# EAGLE design bt_bio (EAGLE 6.6.0)
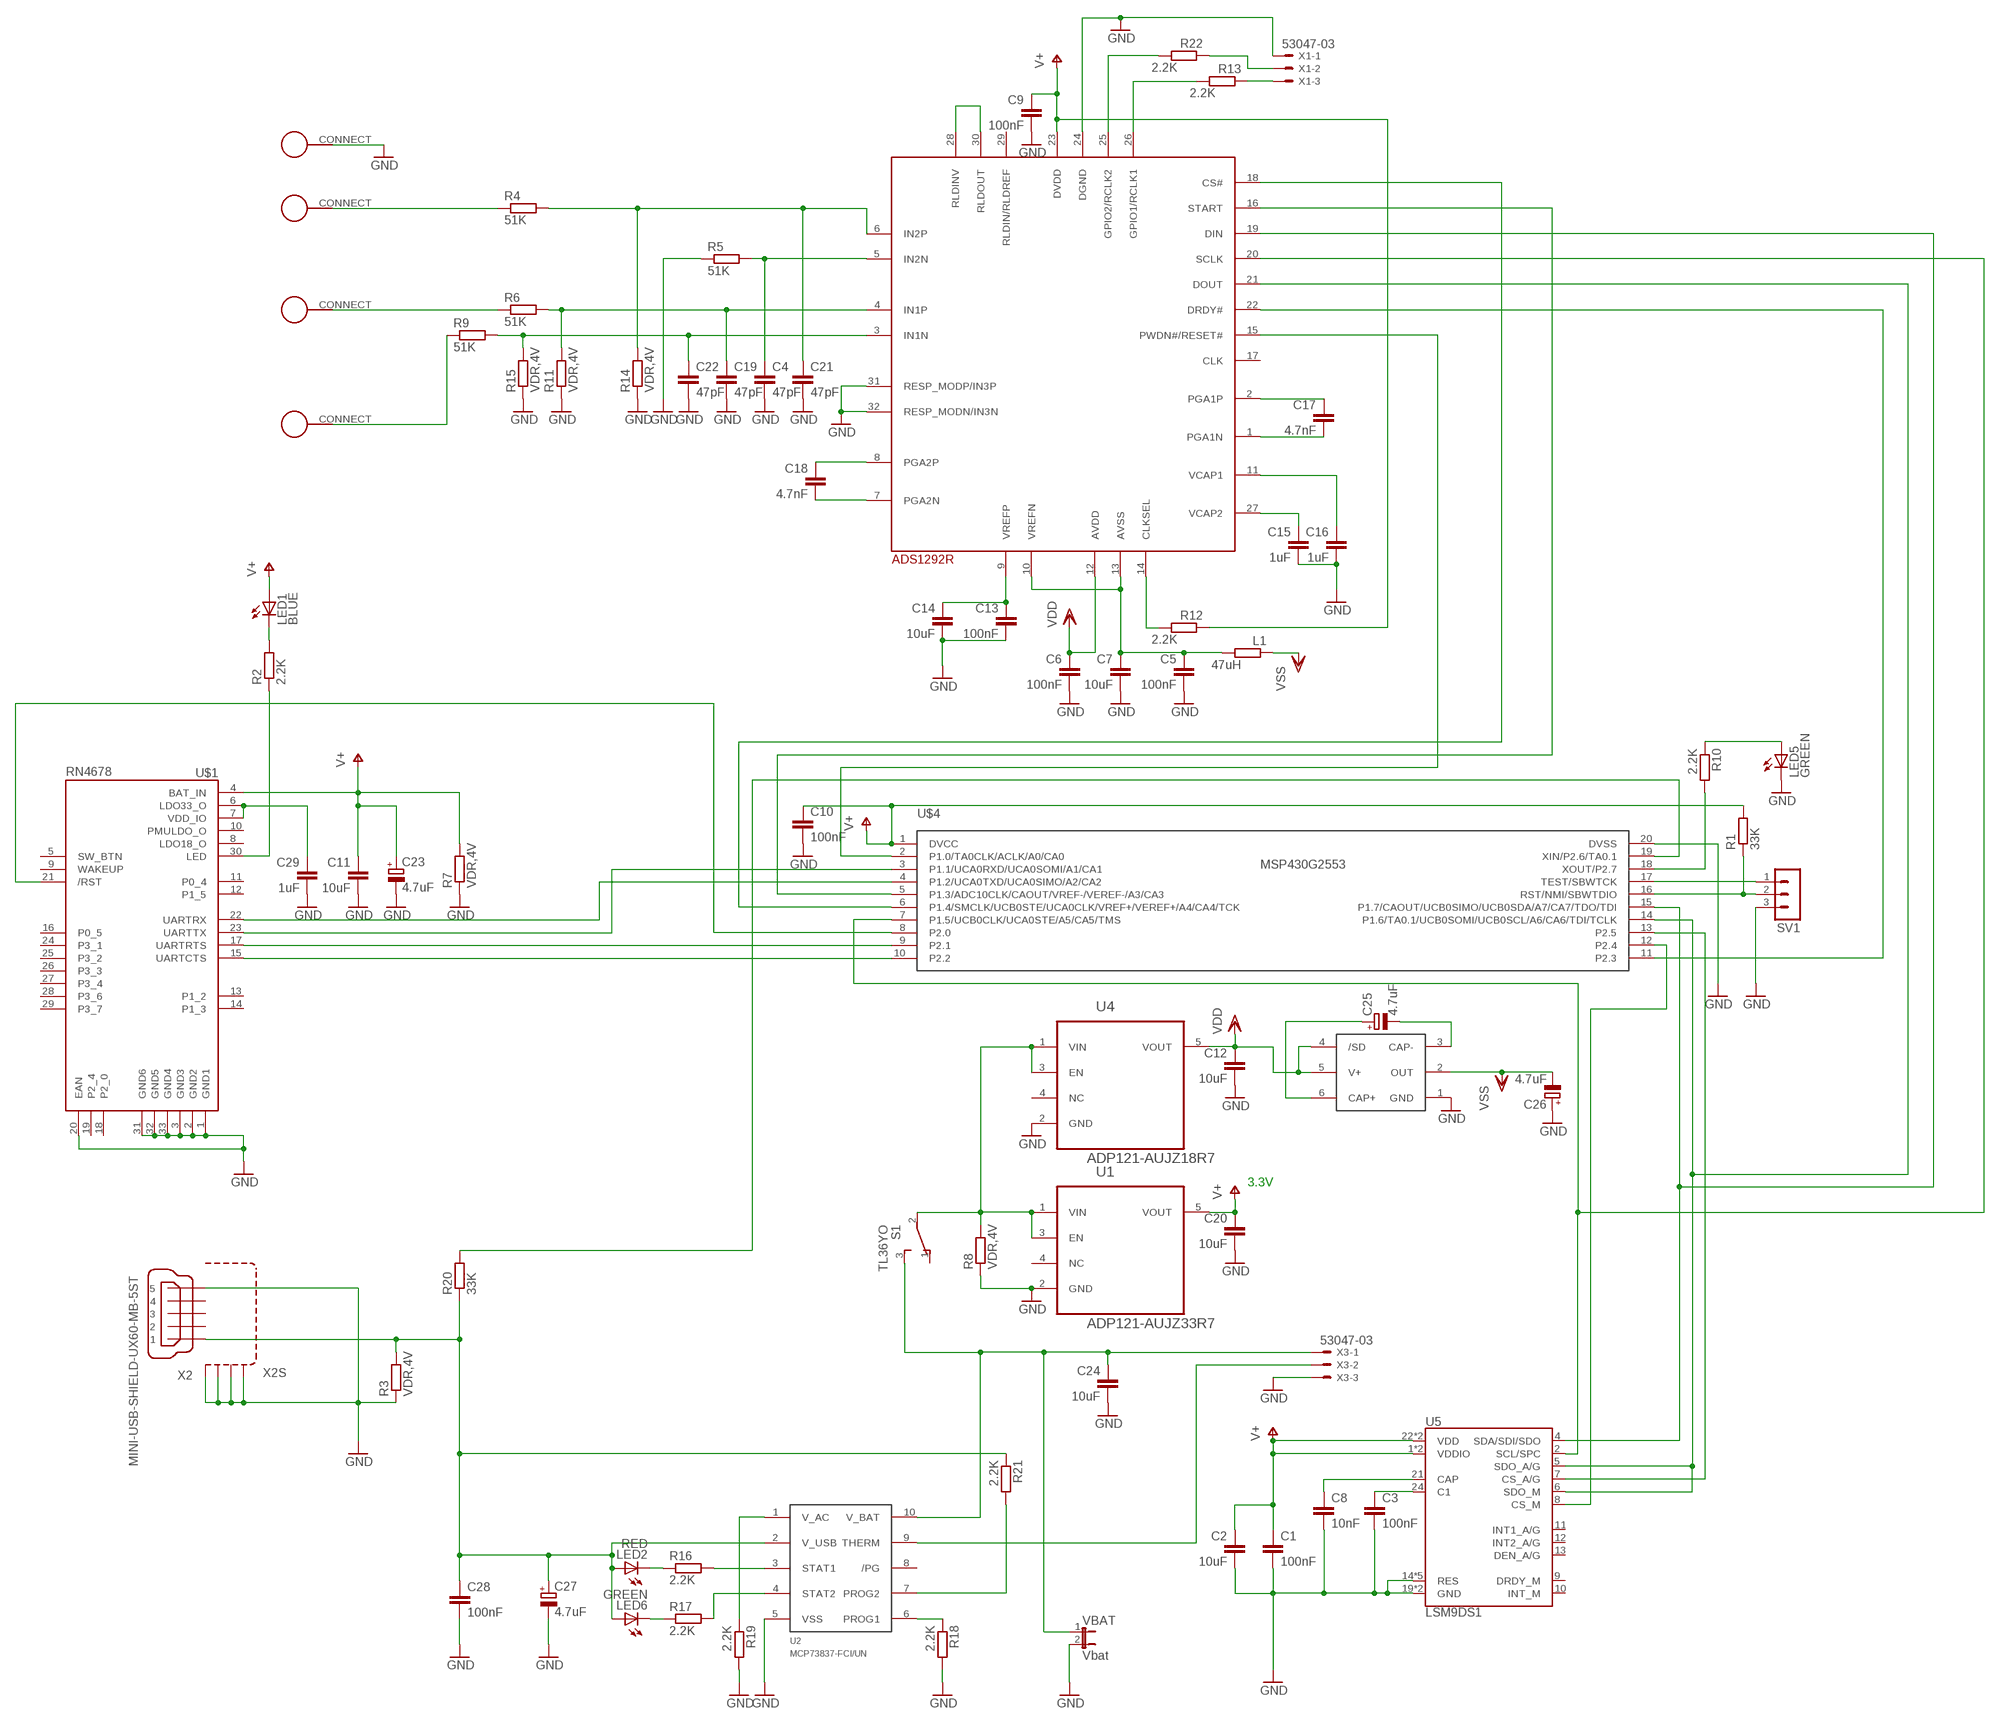
[diagram p0: schematic, sheet 1]

## Parts
ADS1292R  ADS1292R  [TQFP-32]
C1  100nF  C-EUC0603  [C0603]
C2  10uF  C-EUC1206  [C1206]
C3  100nF  C-EUC0603  [C0603]
C4  47pF  C-EUC0603  [C0603]
C5  100nF  C-EUC0603  [C0603]
C6  100nF  C-EUC0603  [C0603]
C7  10uF  C-EUC1206  [C1206]
C8  10nF  C-EUC0603  [C0603]
C9  100nF  C-EUC0603  [C0603]
C10  100nF  C-EUC0603  [C0603]
C11  10uF  C-EUC1206  [C1206]
C12  10uF  C-EUC1206  [C1206]
C13  100nF  C-EUC0603  [C0603]
C14  10uF  C-EUC1206  [C1206]
C15  1uF  C-EUC0603  [C0603]
C16  1uF  C-EUC0603  [C0603]
C17  4.7nF  C-EUC0603  [C0603]
C18  4.7nF  C-EUC0603  [C0603]
C19  47pF  C-EUC0603  [C0603]
C20  10uF  C-EUC1206  [C1206]
C21  47pF  C-EUC0603  [C0603]
C22  47pF  C-EUC0603  [C0603]
C23  4.7uF  CPOL-EUSMCC  [SMC_C]
C24  10uF  C-EUC1206  [C1206]
C25  4.7uF  CPOL-EUSMCC  [SMC_C]
C26  4.7uF  CPOL-EUSMCC  [SMC_C]
C27  4.7uF  CPOL-EUSMCC  [SMC_C]
C28  100nF  C-EUC0603  [C0603]
C29  1uF  C-EUC0603  [C0603]
L1  47uH  R-EU_R0805  [R0805]
LED1  BLUE  LEDCHIPLED_0805  [CHIPLED_0805]
LED2  RED  LEDCHIPLED_0805  [CHIPLED_0805]
LED5  GREEN  LEDCHIPLED_0805  [CHIPLED_0805]
LED6  GREEN  LEDCHIPLED_0805  [CHIPLED_0805]
R1  33K  R-EU_R0603  [R0603]
R2  2.2K  R-EU_R0603  [R0603]
R3  VDR,4V  R-EU_R0805  [R0805]
R4  51K  R-EU_R0603  [R0603]
R5  51K  R-EU_R0603  [R0603]
R6  51K  R-EU_R0603  [R0603]
R7  VDR,4V  R-EU_R0805  [R0805]
R8  VDR,4V  R-EU_R0805  [R0805]
R9  51K  R-EU_R0603  [R0603]
R10  2.2K  R-EU_R0603  [R0603]
R11  VDR,4V  R-EU_R0805  [R0805]
R12  2.2K  R-EU_R0603  [R0603]
R13  2.2K  R-EU_R0603  [R0603]
R14  VDR,4V  R-EU_R0805  [R0805]
R15  VDR,4V  R-EU_R0805  [R0805]
R16  2.2K  R-EU_R0603  [R0603]
R17  2.2K  R-EU_R0603  [R0603]
R18  2.2K  R-EU_R0603  [R0603]
R19  2.2K  R-EU_R0603  [R0603]
R20  33K  R-EU_R0603  [R0603]
R21  2.2K  R-EU_R0603  [R0603]
R22  2.2K  R-EU_R0603  [R0603]
S1  TL36YO  [TL3XYO]
SV1  MA03-1  [MA03-1]
U1  ADP121-AUJZ33R7  [SOT95P280X100-5N]
U2  MCP73837-FCI/UN  MCP73837  [MSOP10]
U4  ADP121-AUJZ18R7  ADP121-AUJZ33R7  [SOT95P280X100-5N]
U5  LSM9DS1  [LGA24-8X4]
U$1  RN4678  [RN4678]
U$4  MSP430G2553  [TSSOP20]
U$5  4MMCONNECT  [4MMCONNECT]
U$7  4MMCONNECT  [4MMCONNECT]
U$9  4MMCONNECT  [4MMCONNECT]
U$10  4MMCONNECT  [4MMCONNECT]
U$12  LM2664  [SOT-23-5]
VBAT  Vbat  JP1E  [JP1]
X1  53047-03  [53047-03]
X2  MINI-USB-SHIELD-UX60-MB-5ST  [UX60-MB-5ST]
X3  53047-03  [53047-03]

## Nets
+5V: C27.+ C28.1 LED2.A LED6.A R3.2 R20.1 R21.1 U2.2(V_USB) X2.1
CS/: U5.8(CS_M) U$4.12(P2.4)
CTS: U$1.15(UARTCTS) U$4.10(P2.2)
ECG_/CS: ADS1292R.18(CS#) U$4.6(P1.4/SMCLK/UCB0STE/UCA0CLK/VREF+/VEREF+/A4/CA4/TCK)
ECG_/DRDY: ADS1292R.22(DRDY#) U$4.11(P2.3)
ECG_START: ADS1292R.16(START) U$4.5(P1.3/ADC10CLK/CAOUT/VREF-/VEREF-/A3/CA3)
GND: ADS1292R.24(DGND) ADS1292R.31(RESP_MODP/IN3P) ADS1292R.32(RESP_MODN/IN3N) C1.2 C2.2 C3.2 C4.2 C5.2 C6.2 C7.2 C8.2 C9.2 C10.2 C11.2 C12.2 C13.2 C14.2 C15.2 C16.2 C19.2 C20.2 C21.2 C22.2 C23.- C24.2 C26.+ C27.- C28.2 C29.2 LED5.C R3.1 R5.1 R7.1 R8.1 R11.1 R14.1 R15.1 R18.2 R19.2 SV1.3 U1.2(GND) U2.5(VSS) U4.2(GND) U5.14(RES) U5.15(RES) U5.16(RES) U5.17(RES) U5.18(RES) U5.19(GND) U5.20(GND) U$1.1(GND1) U$1.2(GND2) U$1.3(GND3) U$1.20(EAN) U$1.31(GND6) U$1.32(GND5) U$1.33(GND4) U$4.20(DVSS) U$5.CONNECT U$12.1(GND) VBAT.2 X1.1 X2.5 X2.M1(S1) X2.M2(S2) X2.M3(S3) X2.M4(S4) X3.3
N$1: R1.1 SV1.2 U$4.16(RST/NMI/SBWTDIO)
N$2: C29.1 U$1.6(LDO33_O) U$1.7(VDD_IO)
N$3: ADS1292R.28(RLDINV) ADS1292R.30(RLDOUT)
N$4: ADS1292R.5(IN2N) C4.1 R5.2
N$5: SV1.1 U$4.17(TEST/SBWTCK)
N$6: R2.1 U$1.30(LED)
N$11: R8.2 S1.2(P) U1.1(VIN) U1.3(EN) U4.1(VIN) U4.3(EN)
N$12: ADS1292R.10(VREFN) ADS1292R.13(AVSS) C5.1 C7.1 L1.2
N$15: R10.2 U$4.18(XOUT/P2.7)
N$16: LED5.A R10.1
N$17: LED1.C R2.2
N$18: ADS1292R.25(GPIO2/RCLK2) R22.2
N$19: ADS1292R.9(VREFP) C13.1 C14.1
N$20: ADS1292R.27(VCAP2) C15.1
N$21: ADS1292R.26(GPIO1/RCLK1) R13.2
N$22: ADS1292R.11(VCAP1) C16.1
N$23: R20.2 U$4.19(XIN/P2.6/TA0.1)
N$24: ADS1292R.15(PWDN#/RESET#) U$4.2(P1.0/TA0CLK/ACLK/A0/CA0)
N$25: U5.7(CS_A/G) U$4.13(P2.5)
N$26: C3.1 U5.24(C1)
N$27: C8.1 U5.21(CAP)
N$28: R13.1 X1.3
N$30: R22.1 X1.2
N$31: C24.1 S1.3(S) U2.10(V_BAT) VBAT.1 X3.1
N$32: ADS1292R.2(PGA1P) C17.1
N$33: ADS1292R.1(PGA1N) C17.2
N$34: ADS1292R.8(PGA2P) C18.1
N$35: ADS1292R.7(PGA2N) C18.2
N$36: ADS1292R.14(CLKSEL) R12.2
N$37: ADS1292R.6(IN2P) C21.1 R4.2 R14.2
N$39: ADS1292R.3(IN1N) C22.1 R9.2 R15.2
N$40: ADS1292R.4(IN1P) C19.1 R6.2 R11.2
N$41: R4.1 U$7.CONNECT
N$42: R9.1 U$10.CONNECT
N$43: R6.1 U$9.CONNECT
N$47: C25.+ U$12.6(CAP+)
N$48: C25.- U$12.3(CAP-)
N$49: R16.2 U2.3(STAT1)
N$50: LED6.C R17.1
N$51: R17.2 U2.4(STAT2)
N$52: LED2.C R16.1
N$53: R18.1 U2.6(PROG1)
N$54: U2.9(THERM) X3.2
N$55: R19.1 U2.1(V_AC)
N$57: R21.2 U2.7(PROG2)
RESET: U$1.21(/RST) U$4.8(P2.0)
RTS: U$1.17(UARTRTS) U$4.9(P2.1)
RX: U$1.22(UARTRX) U$4.4(P1.2/UCA0TXD/UCA0SIMO/A2/CA2)
SPI_CLK: ADS1292R.20(SCLK) U5.2(SCL/SPC) U$4.7(P1.5/UCB0CLK/UCA0STE/A5/CA5/TMS)
SPI_MISO: ADS1292R.21(DOUT) U5.5(SDO_A/G) U5.6(SDO_M) U$4.14(P1.6/TA0.1/UCB0SOMI/UCB0SCL/A6/CA6/TDI/TCLK)
SPI_MOSI: ADS1292R.19(DIN) U5.4(SDA/SDI/SDO) U$4.15(P1.7/CAOUT/UCB0SIMO/UCB0SDA/A7/CA7/TDO/TDI)
TX: U$1.23(UARTTX) U$4.3(P1.1/UCA0RXD/UCA0SOMI/A1/CA1)
V+: ADS1292R.23(DVDD) C1.1 C2.1 C9.1 C10.1 C11.1 C20.1 C23.+ LED1.A R1.2 R7.2 R12.1 U1.5(VOUT) U5.1(VDDIO) U5.3(VDDIO) U5.22(VDD) U5.23(VDD) U$1.4(BAT_IN) U$4.1(DVCC)
VDD: ADS1292R.12(AVDD) C6.1 C12.1 U4.5(VOUT) U$12.4(/SD) U$12.5(V+)
VSS: C26.- L1.1 U$12.2(OUT)
Unconnected: ADS1292R.17(CLK) ADS1292R.29(RLDIN/RLDREF) S1.1(O) U1.4(NC) U2.8(/PG) U4.4(NC) U5.9(DRDY_M) U5.10(INT_M) U5.11(INT1_A/G) U5.12(INT2_A/G) U5.13(DEN_A/G) U$1.5(SW_BTN) U$1.8(LDO18_O) U$1.9(WAKEUP) U$1.10(PMULDO_O) U$1.11(P0_4) U$1.12(P1_5) U$1.13(P1_2) U$1.14(P1_3) U$1.16(P0_5) U$1.18(P2_0) U$1.19(P2_4) U$1.24(P3_1) U$1.25(P3_2) U$1.26(P3_3) U$1.27(P3_4) U$1.28(P3_6) U$1.29(P3_7) X2.2 X2.3 X2.4

## Notes on the sheet
- 3.3V

## Library data of the parts
ADS1292R = ewhbp:ADS1292R
C1-C22 C24 C28 C29 = rcl:C-EU: CAPACITOR, European symbol
C23 C25-C27 = rcl:CPOL-EU: POLARIZED CAPACITOR, European symbol
L1 R2-R19 R21 R22 = rcl:R-EU_: RESISTOR, European symbol
LED1 LED2 LED5 LED6 = led:LED: LED OSRAM: - CHIPLED LG R971, LG N971, LY N971, LG Q971, LY Q971, LO R971, LY R971 LH N974, LH R974 LS Q976, LO Q976, LY Q976 LO Q996 - Hyper CHIPLED LW Q18S LB Q993, LB Q99A, LB R99A - SideLED LS A670, LO A670, LY A670, LG A670, LP A670 LB A673, LV A673, LT A673, LW A673 LH A674 LY A675 LS A676, LA A676, LO A676, LY A676, LW A676 LS A679, LY A679, LG A679 - Hyper Micro SIDELED® LS Y876, LA Y876, LO Y876, LY Y876 LT Y87S - SmartLED LW L88C, LW L88S LB L89C, LB L89S, LG L890 LS L89K, LO L89K, LY L89K LS L896, LA L896, LO L896, LY L896 - TOPLED LS T670, LO T670, LY T670, LG T670, LP T670 LSG T670, LSP T670, LSY T670, LOP T670, LYG T670 LG T671, LOG T671, LSG T671 LB T673, LV T673, LT T673, LW T673 LH T674 LS T676, LA T676, LO T676, LY T676, LB T676, LH T676, LSB T676, LW T676 LB T67C, LV T67C, LT T67C, LS T67K, LO T67K, LY T67K, LW E67C LS E67B, LA E67B, LO E67B, LY E67B, LB E67C, LV E67C, LT E67C LW T67C LS T679, LY T679, LG T679 LS T770, LO T770, LY T770, LG T770, LP T770 LB T773, LV T773, LT T773, LW T773 LH T774 LS E675, LA E675, LY E675, LS T675 LS T776, LA T776, LO T776, LY T776, LB T776 LHGB T686 LT T68C, LB T68C - Hyper Mini TOPLED® LB M676 - Mini TOPLED Santana® LG M470 LS M47K, LO M47K, LY M47K Source: http://www.osram.convergy.de - LUMILED® LXK2-PW12-R00, LXK2-PW12-S00, LXK2-PW14-U00, LXK2-PW14-V00 LXK2-PM12-R00, LXK2-PM12-S00, LXK2-PM14-U00 LXK2-PE12-Q00, LXK2-PE12-R00, LXK2-PE12-S00, LXK2-PE14-T00, LXK2-PE14-U00 LXK2-PB12-K00, LXK2-PB12-L00, LXK2-PB12-M00, LXK2-PB14-N00, LXK2-PB14-P00, LXK2-PB14-Q00 LXK2-PR12-L00, LXK2-PR12-M00, LXK2-PR14-Q00, LXK2-PR14-R00 LXK2-PD12-Q00, LXK2-PD12-R00, LXK2-PD12-S00 LXK2-PH12-R00, LXK2-PH12-S00 LXK2-PL12-P00, LXK2-PL12-Q00, LXK2-PL12-R00 Source: www.luxeon.com
R1 R20 = resistor:R-EU_: RESISTOR, European symbol
S1 = switch:TL36YO: TINY SWITCH ON - ON Source: http://www2.produktinfo.conrad.com/datenblaetter/700000-724999/705152-da-01-de-Subminiaturschalter_TL_36YO.pdf
SV1 = con-lstb:MA03-1: PIN HEADER; OC_FARNELL: unknown; OC_NEWARK: unknown
U1 U4 = adp121:ADP121-AUJZ33R7: 150 mA, Low Quiescent Current, CMOS Linear Regulator; MPN: ADP121-AUJZ33R7; OC_FARNELL: 2074869; OC_NEWARK: 10R7024; PACKAGE: TSOT-5; SUPPLIER: Analog Devices
U2 = charger:MCP73837
U5 = LSM9DS1:LSM9DS1: LSM9DS1 3D accelerometer, gyroscope & magnetometer The LSM9DS1 is a system-in-package featuring a 3D digital linear acceleration sensor, a 3D digital angular rate sensor, and a 3D digital magnetic sensor. The LSM9DS1 has a linear acceleration full scale of ±2g/±4g/±8/±16 g, a magnetic field full scale of ±4/±8/±12/±16 gauss and an angular rate of ±245/±500/±2000 dps. The LSM9DS1 includes an I2 C serial bus interface supporting standard and fast mode (100 kHz and 400 kHz) and an SPI serial standard interface. Magnetic, accelerometer and gyroscope sensing can be enabled or set in power-down mode separately for smart power management. The LSM9DS1 is available in a plastic land grid array package (LGA) and it is guaranteed to operate over an extended temperature range from -40 °C to +85 °C.; PROD_ID: IC-12536
U$1 = rn4678:RN4678
U$4 = msp430g2553:MSP430G2553
U$5 U$7 U$9 U$10 = project1:4MMCONNECT
U$12 = charge_pump:LM2664
VBAT = jumper:JP1E: JUMPER
X1 X3 = con-molex:53?-03: CONNECTOR wire to board 1.25 mm (.049 inch) pitch header; MPN: 530470310; OC_FARNELL: 9732853; OC_NEWARK: 14R5412
X2 = con-hirose:MINI-USB-SHIELD-: MINI USB Connector Source: http://www.hirose.co.jp/cataloge_hp/e24000019.pdf; OC_FARNELL: unknown; OC_NEWARK: unknown

## Board
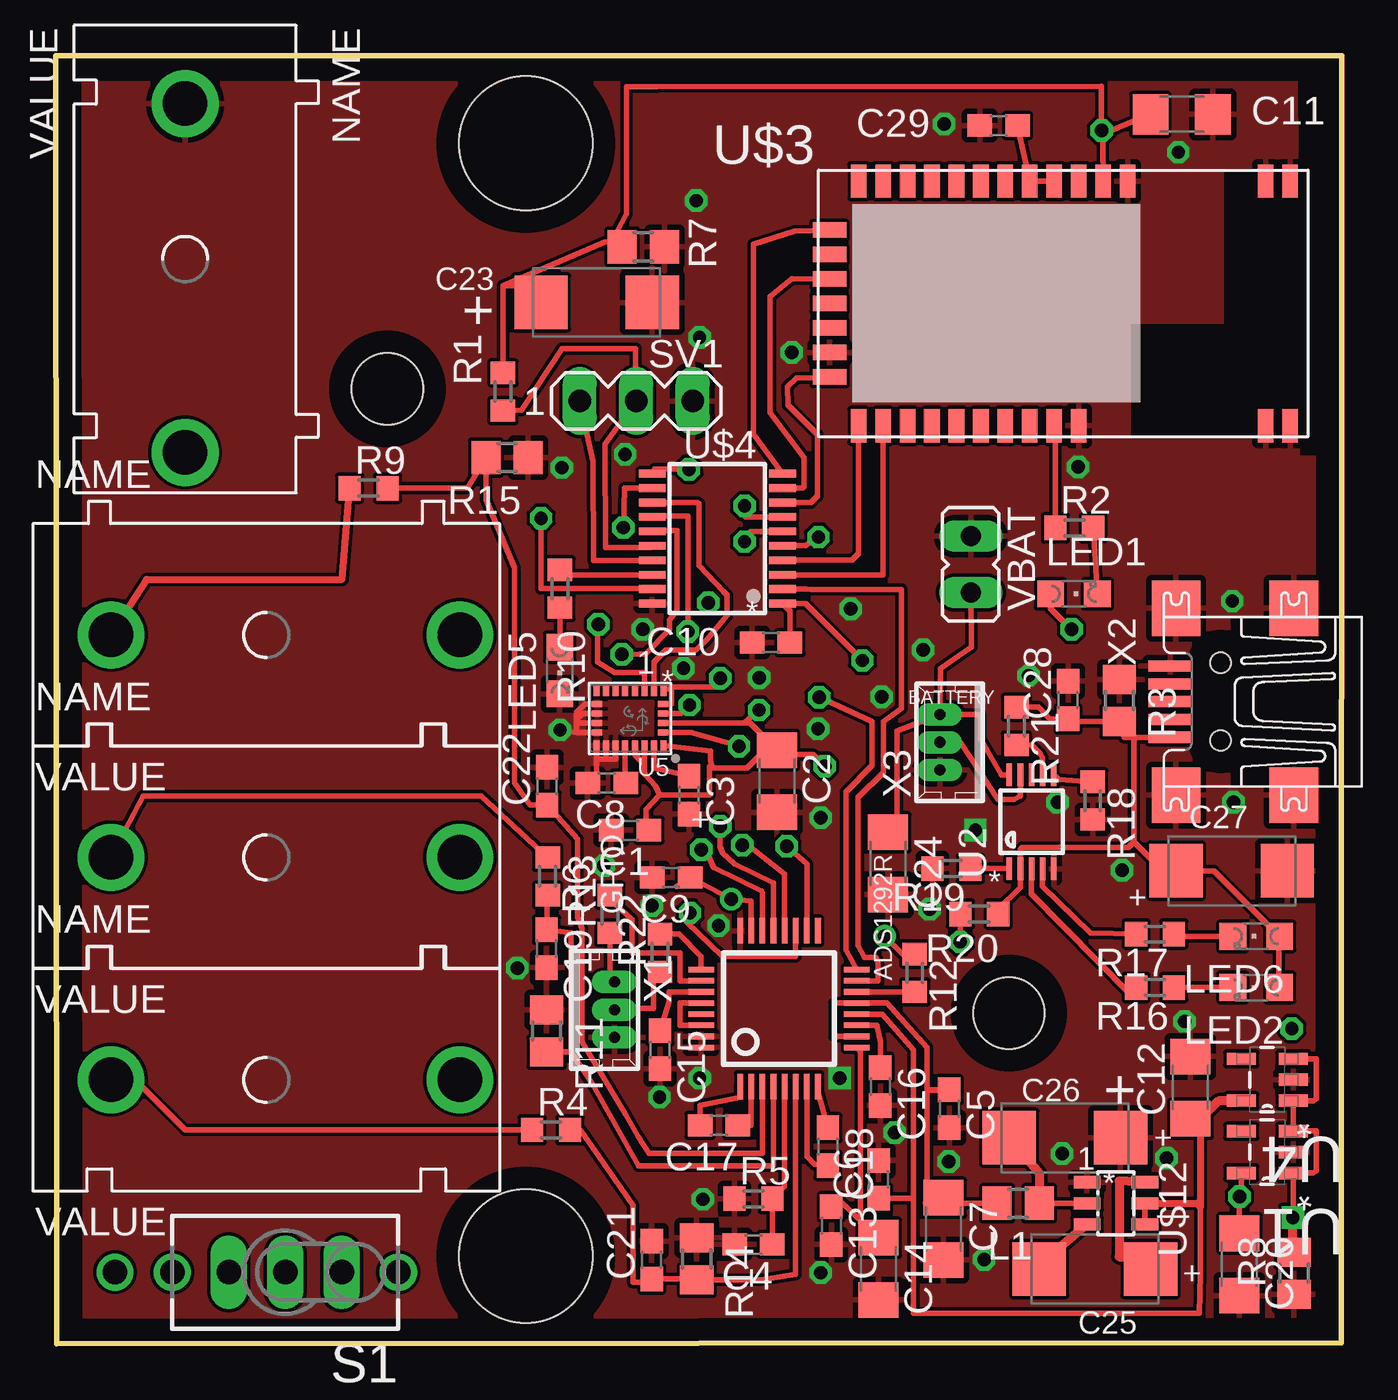
[diagram p1: board, top side]
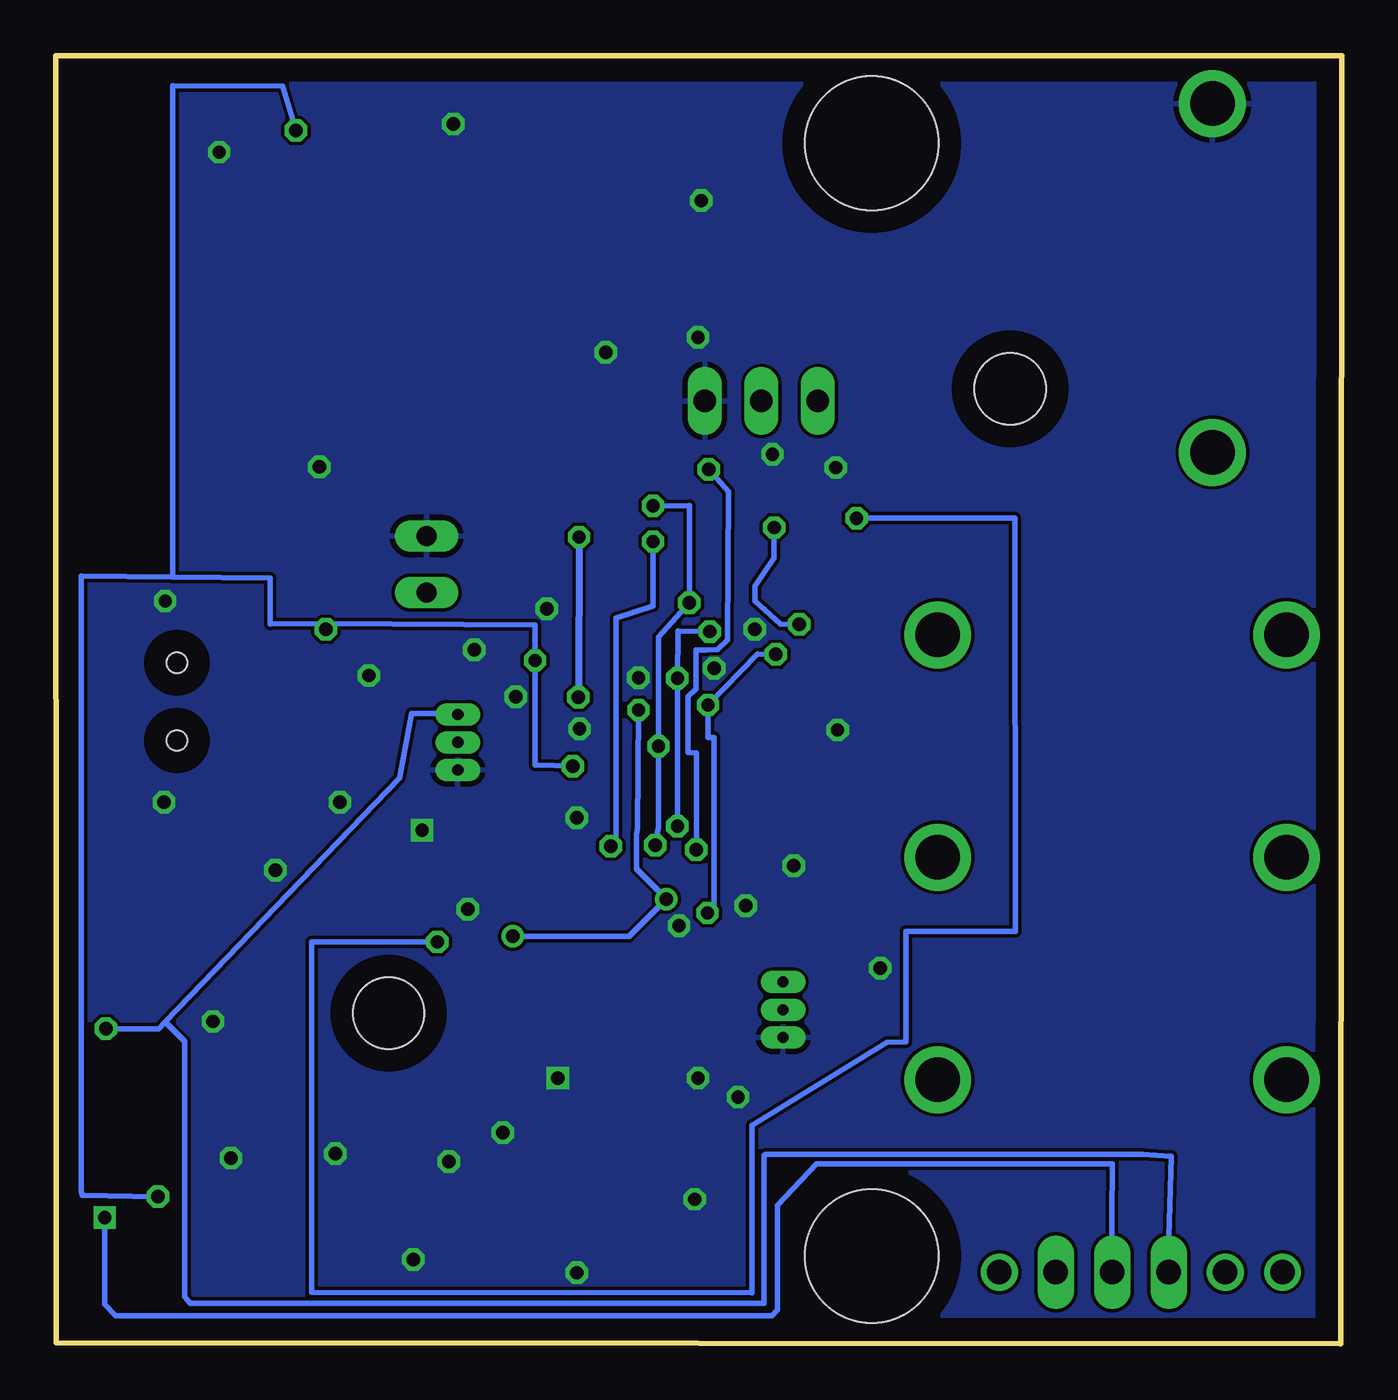
[diagram p2: board, bottom side, seen from below]

Size 57.83 x 57.92 mm. Coordinates in mm from the lower left corner, seen from the top.
Outline: 0.05,0 57.8,0.05 57.83,57.92 0,57.92 0.05,0
Copper layers (1*16): Top 0.035mm / dielectric 1.5mm / Bottom 0.035mm
Design rules "default": minimum track width 10mil, minimum drill 24mil, track to track 6mil, track to pad 6mil, pad to pad 6mil, via to via 6mil, smd to smd 6mil, copper to edge 40mil, drill to drill 8mil, minimum pad ring 10mil, minimum via ring 8mil, stop-mask expansion 4mil, vias tented up to drill 0mil, thermal gap 10mil
Holes 3.2 mm at 14.92,42.93 42.86,14.87
Holes 6 mm at 21.14,3.95 21.14,53.98

### Footprints (pad centres in the part's own frame; a part is rotated, then mirrored left to right if it is on the bottom)
TQFP-32 = smd 1.143 x 0.254: 1 -3.5,1.75; 2 -3.5,1.25; 3 -3.5,0.75; 4 -3.5,0.25; 5 -3.5,-0.25; 6 -3.5,-0.75; 7 -3.5,-1.25; 8 -3.5,-1.75; 17 3.5,-1.75; 18 3.5,-1.25; 19 3.5,-0.75; 20 3.5,-0.25; 21 3.5,0.25; 22 3.5,0.75; 23 3.5,1.25; 24 3.5,1.75 | smd 0.254 x 1.143: 9 -1.75,-3.5; 10 -1.25,-3.5; 11 -0.75,-3.5; 12 -0.25,-3.5; 13 0.25,-3.5; 14 0.75,-3.5; 15 1.25,-3.5; 16 1.75,-3.5; 25 1.75,3.5; 26 1.25,3.5; 27 0.75,3.5; 28 0.25,3.5; 29 -0.25,3.5; 30 -0.75,3.5; 31 -1.25,3.5; 32 -1.75,3.5
C0603 = smd 1.1 x 1: 1 -0.85,0; 2 0.85,0
C1206 = smd 1.6 x 1.8: 1 -1.4,0; 2 1.4,0
SMC_C = smd 2.4 x 2.4: + -2.5,0; - 2.5,0
R0805 = smd 1.3 x 1.5: 1 -0.95,0; 2 0.95,0
CHIPLED_0805 = smd 1.2 x 1.2: A 0,-1.05; C 0,1.05
R0603 = smd 1 x 1.1: 1 -0.85,0; 2 0.85,0
TL3XYO = drill 1.1 pad 1.422 long: 1 -2.54,0; 2 0,0; 3 2.54,0 | drill 1.1 pad 1.676: M1 -5.08,0; M2 5.08,0
MA03-1 = drill 1.016 long: 1 -2.54,0; 2 0,0; 3 2.54,0
SOT95P280X100-5N = smd 1.321 x 0.559: 1 -1.168,0.94; 2 -1.168,0; 3 -1.168,-0.94; 4 1.168,-0.94; 5 1.168,0.94
MSOP10 = smd 0.25 x 1: 1 -1,-2.113; 2 -0.5,-2.113; 3 0,-2.113; 4 0.5,-2.113; 5 1,-2.113; 6 1,2.113; 7 0.5,2.113; 8 0,2.113; 9 -0.5,2.113; 10 -1,2.113
LGA24-8X4 = smd 0.27 x 0.45: 1 -1.505,1.225; 6 -1.505,-1.225; 7 -1.075,-1.225; 8 -0.645,-1.225; 9 -0.215,-1.225; 10 0.215,-1.225; 11 0.645,-1.225; 12 1.075,-1.225; 13 1.505,-1.225; 18 1.505,1.225; 19 1.075,1.225; 20 0.645,1.225; 21 0.215,1.225; 22 -0.215,1.225; 23 -0.645,1.225; 24 -1.075,1.225 | smd 0.45 x 0.27: 2 -1.475,0.645; 3 -1.475,0.215; 4 -1.475,-0.215; 5 -1.475,-0.645; 14 1.475,-0.645; 15 1.475,-0.215; 16 1.475,0.215; 17 1.475,0.645
RN4678 = smd 1.5 x 0.7: 1 0.5,21.2; 2 0.5,20.1; 3 0.5,13.9; 4 0.5,12.8; 5 0.5,11.7; 6 0.5,10.6; 7 0.5,9.5; 8 0.5,8.4; 9 0.5,7.3; 10 0.5,6.2; 11 0.5,5.1; 12 0.5,4; 13 0.5,2.9; 14 0.5,1.8; 22 11.5,1.8; 23 11.5,2.9; 24 11.5,4; 25 11.5,5.1; 26 11.5,6.2; 27 11.5,7.3; 28 11.5,8.4; 29 11.5,9.5; 30 11.5,10.6; 31 11.5,11.7; 32 11.5,20.1; 33 11.5,21.2 | smd 0.7 x 1.5: 15 2.7,0.5; 16 3.8,0.5; 17 4.9,0.5; 18 6,0.5; 19 7.1,0.5; 20 8.2,0.5; 21 9.3,0.5
TSSOP20 = smd 0.35 x 1.2: 1 -3.545,-2.925; 2 -2.895,-2.925; 3 -2.245,-2.925; 4 -1.595,-2.925; 5 -0.945,-2.925; 6 -0.295,-2.925; 7 0.355,-2.925; 8 1.005,-2.925; 9 1.655,-2.925; 10 2.305,-2.925; 11 2.305,2.925; 12 1.655,2.925; 13 1.005,2.925; 14 0.355,2.925; 15 -0.295,2.925; 16 -0.945,2.925; 17 -1.595,2.925; 18 -2.245,2.925; 19 -2.895,2.925; 20 -3.545,2.925
4MMCONNECT = drill 2 pad 2.794: CONNECT -6.985,0; PLACE 8.7,0
SOT-23-5 = smd 0.55 x 1.2: 1 -0.95,-1.3; 2 0,-1.3; 3 0.95,-1.3; 4 0.95,1.3; 5 0.003,1.3; 6 -0.95,1.3
JP1 = drill 0.914 long: 1 0,-1.27; 2 0,1.27
53047-03 = drill 0.5 pad 0.698 long: 1 1.25,0.45; 2 0,0.45; 3 -1.25,0.45
UX60-MB-5ST = smd 2 x 0.5: 1 2.25,1.6; 2 2.25,0.8; 3 2.25,0; 4 2.25,-0.8; 5 2.25,-1.6 | smd 2.2 x 2.5: M1 -3.3,-4.2; M2 -3.3,4.2; M3 2,4.2; M4 2,-4.2 | hole 0.9: 0,-1.75; 0,1.75

### Placement (x,y rotation side)
ADS1292R  32.52,15.07 90 top
C1  25.82,23.1 180 top
C2  32.42,25.3 270 top
C3  28.47,24.67 270 top
C4  31.37,4.47 180 top
C5  40.17,10.57 270 top
C6  37,7.4 90 top
C7  39.92,5.17 270 top
C8  24.77,25.22 180 top
C9  27.67,20.97 180 top
C10  32.16,31.54 180 top
C11  50.62,55.27 0 top
C12  51.02,11.52 90 top
C13  34.87,5.32 270 top
C14  37,3.37 270 top
C15  27.17,13.22 270 top
C16  37.07,11.57 270 top
C17  29.82,9.82 180 top
C18  34.72,8.87 270 top
C19  22.07,17.77 270 top
C20  53.22,3.57 270 top
C21  26.8,3.77 90 top
C22  22.1,25.07 90 top
C23  24.32,46.82 0 top
C24  37.42,21.6 270 top
C25  46.72,3.37 180 top
C26  45.37,9.27 180 top
C27  52.87,21.27 0 top
C28  45.52,28.95 90 top
C29  42.4,54.77 180 top
L1  43.27,6.32 180 top
LED1  45.78,33.72 270 top
LED2  53.97,16.02 90 top
LED5  22.66,30.27 180 top
LED6  53.97,18.32 90 top
R1  20.11,42.81 90 top
R2  45.8,36.68 0 top
R3  47.82,28.92 270 top
R4  22.27,9.62 0 top
R5  31.37,6.52 0 top
R6  22.12,21.02 270 top
R7  26.42,49.32 180 top
R8  55.67,3.17 90 top
R9  14.07,38.47 0 top
R10  22.68,33.95 90 top
R11  22.07,14.07 270 top
R12  38.62,16.67 270 top
R13  24.92,19.32 90 top
R14  28.82,3.82 270 top
R15  20.3,39.85 180 top
R16  49.42,16.02 180 top
R17  49.42,18.42 180 top
R18  46.62,24.42 270 top
R19  40.27,21.37 180 top
R20  41.52,19.32 180 top
R21  43.2,27.77 270 top
R22  27.17,17.57 90 top
S1  10.32,3.22 180 top
SV1  26.1,42.39 0 top
U1  54.47,8.62 180 top
U2  43.87,23.47 0 top
U4  54.47,11.87 180 top
U5  25.82,28.12 180 top
U$1  34.3,52.77 270 top
U$4  29.75,36.82 90 top
U$5  5.82,48.77 270 top
U$7  9.47,11.87 0 top
U$9  9.47,21.87 0 top
U$10  9.47,31.87 0 top
U$12  47.67,6.32 270 top
VBAT  41.15,35.05 0 top
X1  24.67,15.02 270 top
X2  52.37,28.87 180 top
X3  40.2,27.05 90 top

### Tracks (layer width: path | path; a pad name or v marks a point on that pad's centre or on a via)
+5V
  Top 0.254: X2.1 48.57,27.27 | 48.57,27.27 48.05,27.27 R3.2 45.55,27.98 C28.1 44.67,28.12 44.17,28.62 R21.1 | 48.47,22.57 49.77,21.27 C27.+ 52.07,21.27 LED6.A 54.97,18.27 LED2.A | 48.47,22.57 48.47,27.17 48.57,27.27 | 48.47,22.57 48.22,22.32 43.47,22.32 43.37,22.22 U2.2 43.37,20.52 42.37,19.52 R20.1
CS/  (via drill 0.6)
  Top 0.254: U$4.12 25.57,38.48 v25.52,36.7 | v24.4,32.35 24.37,32.37 24.37,30.65 25.12,30.17 26.47,30.17 U5.8
  Bottom 0.254: v25.52,36.7 25.52,35.32 26.4,34.07 26.4,33.4 25.25,32.37 v24.4,32.35
CTS
  Top 0.254: U$4.10 31.37,40.9 31.37,44.45 31.37,49.45 33.22,50.02 U$1.15
ECG_/CS  (via drill 0.6)
  Top 0.254: U$4.6 31.23,36.53 v30.97,36.07 | v32.87,22.37 33.77,21.57 ADS1292R.18
  Bottom 0.254: v30.97,36.07 30.97,33.17 32.62,32.62 32.62,22.37 v32.87,22.37
ECG_/DRDY  (via drill 0.6)
  Top 0.254: ADS1292R.22 31.77,20.27 31.72,20.37 29.57,21.42 29.42,21.77 29.37,21.92 v29.02,22.22 | v28.47,39.32 26.92,39.32 U$4.11
  Bottom 0.254: v29.02,22.22 29.02,26.57 29.4,26.6 29.4,29.1 29.05,29.45 29.05,31.2 28.6,31.2 28.07,31.22 27.62,31.65 27.57,38.32 v28.47,39.32
ECG_START  (via drill 0.6)
  Top 0.254: U$4.5 33.72,35.88 v34.3,36.27 | ADS1292R.16 35.52,17.72 35.52,24.82 36.7,26 36.7,27.97 v34.32,29.07
  Bottom 0.305: v34.3,36.27 v34.32,29.07
GND  (via drill 0.6)
  Top 0.254: 24.32,26.8 U5.18 24.32,26.32 | 24.32,26.32 24.32,25.42 C8.2 | U5.20 25.18,26.32 25.2,26.3 24.75,26.3 | 24.75,26.3 24.34,26.3 24.32,26.32 | U5.19 24.75,26.3 | U5.17 23.47,27.48 | 23.47,27.48 22.78,27.55 v22.68,27.6 | U5.14 23.79,28.77 23.42,28.4 23.42,28.07 | 23.42,28.07 23.42,27.92 | 23.42,27.92 23.42,27.53 23.47,27.48 | U5.15 23.69,28.34 23.42,28.07 | U5.16 23.44,27.91 23.42,27.92
  other vias: 37.14,29.1 28.95,45.25 28.8,51.4 26.4,32.12 28.95,11.95 27.15,11.1 29.8,18.8 35.25,11.95 29.1,6.5 20.75,16.9 41.35,23.1 45.05,24.35 47.95,21.3 52.95,24.35 39.3,19.55 49.95,8.35 50.75,14.5 34.4,3.2 22.75,39.4 35.75,33.05 43.75,30.05 39,31.2 52.9,33.4 37.73,9.5 40.15,8.2 45.25,8.55 41.75,3.8 34.4,23.65 31.63,29.95 26.8,19.7 24.65,21.5 25.6,40 34.28,27.65 28.23,30.37 33.1,44.57 39.95,54.85 45.98,39.42 50.48,53.57
  pour Top: -0.03,-0.13 49.25,0.55 58.02,0.65 58.02,34.97 58,39.82 55.82,39.82 55.73,57.33 0.6,57.36
  pour Bottom: 0.44,57.41 0.57,0.52 49.28,0.29 58.02,0.29 58.17,35.27 58.17,38.17 58.22,57.15 48.93,57.18
N$1
  Top 0.254: U$4.16 26.75,35.81 24.71,35.81 24.7,40.45 SV1.2 26.07,44.75 22.78,44.75 20.95,41.97 R1.1
N$2
  Top 0.254: U$1.6 U$1.7 C29.1
N$3
  Top 0.254: ADS1292R.30 28.07,14.32 28.07,15.32 ADS1292R.28
N$4
  Top 0.254: ADS1292R.5 32.77,7.07 R5.2 C4.1
N$5
  Top 0.254: SV1.1 24.16,39.66 24.18,35.22 26.77,35.22 U$4.17
N$6
  Top 0.254: R2.1 44.95,40.35 44.92,41 44.92,40.9 U$1.30
N$11  (via drill 0.6)
  Top 0.254: U4.3 56.67,12.82 56.67,11.02 56.53,10.93 U4.1 U1.3 56.67,9.57 56.67,7.77 56.53,7.68 U1.1 55.64,5.69 v55.62,5.67
  Top 0.406: R8.2 55.62,4.12 v55.62,5.67
  Bottom 0.254: v55.62,5.67 55.62,1.77 55.12,1.27 25.62,1.27 25.37,1.52 25.37,6.22 23.62,8.1 10.32,8.1 10.37,3.27 S1.2
N$12
  Top 0.254: L1.2 39.17,6.32 39.17,11.37 C5.1 39.17,11.42 39.17,13.32 37.37,15.32 ADS1292R.13 35.02,15.32 35.02,13.82 ADS1292R.10
  Top 0.406: 39.17,6.32 40.47,6.52 C7.1
N$13  (via drill 1.1)
  other vias: 2.67,3.22
N$15
  Top 0.254: U$4.18 22.91,34.57 R10.2
N$16
  Top 0.254: R10.1 22.68,31.34 LED5.A
N$17
  Top 0.254: R2.2 LED1.C
N$18
  Top 0.254: ADS1292R.25 29.02,17.42 28.02,18.42 R22.2
N$19
  Top 0.254: ADS1292R.9 36.17,13.17 36.17,5.42 C14.1 35.22,6.47 34.67,6.47 C13.1
N$20
  Top 0.254: C15.1 27.57,15.37 27.57,15.82 ADS1292R.27
N$21
  Top 0.254: ADS1292R.26 28.07,16.32 28.07,17.57 25.92,17.57 25.92,19.07 24.82,20.07 R13.2
N$22
  Top 0.254: C16.1 37.07,13.57 36.92,14.32 ADS1292R.11
N$23  (via drill 0.6)
  Top 0.254: v40.67,18.07 R20.2 | v21.82,37.12 21.82,33.95 26.81,33.95 U$4.19
  Bottom 0.254: v21.82,37.12 14.7,37.12 14.67,18.55 19.6,18.55 19.6,13.57 20.45,13.55 26.52,9.82 26.52,2.3 46.32,2.32 46.32,18.07 v40.67,18.07
N$24
  Top 0.254: U$4.2 33.73,33.93 33.97,33.92 38.02,33.92 38.02,28.57 37.22,27.97 37.22,25.7 36.07,24.57 36.07,17.92 36.37,17.37 36.87,17.37 36.97,17.22 36.97,16.32 ADS1292R.15
N$25
  Top 0.254: U$4.13 28.87,37.83 28.92,37.77 28.92,35 30.02,33.82 30.17,33.67 30.17,32.75 29.27,31.65 28.8,31.2 27.45,31.2 26.9,30.65 U5.7
N$26
  Top 0.254: U5.24 26.9,25.9 C3.1
N$27
  Top 0.254: U5.21 25.61,25.11 C8.1
N$28
  Top 0.254: R13.1 24.92,16.67 X1.3
N$30
  Top 0.254: R22.1 26.87,16.72 26.87,15.07 25.27,15.07 X1.2
N$31  (via drill 0.6)
  Top 0.254: X3.1 41.59,28.3 41.59,27.21 42.52,25.57 U2.10 | 55.64,14.1 v55.57,14.17 | X3.1 37.82,27.55 37.82,23.6 | X3.1 39.77,30.37 41.17,31.32 VBAT.1
  Top 0.406: 37.82,23.6 37.42,23.6 C24.1
  Bottom 0.254: v55.57,14.17 53.19,14.17 52.89,14.48 | 52.89,14.48 42.36,25.45 41.83,28.35 39.92,28.35 X3.1 | 52.89,14.48 52.02,13.61 52.02,2.12 51.77,1.82 25.97,1.82 25.97,8.47 25.92,8.52 8.97,8.52 7.67,8.42 7.77,4.78 S1.3
N$32
  Top 0.254: ADS1292R.2 31.27,9.82 C17.1
N$33
  Top 0.254: ADS1292R.1 30.77,11.07 28.97,10.72 C17.2
N$34
  Top 0.254: ADS1292R.8 34.27,11.32 C18.1
N$35
  Top 0.254: C18.2 34.12,8.07 33.77,8.42 ADS1292R.7
N$36
  Top 0.254: R12.2 ADS1292R.14
N$37
  Top 0.254: ADS1292R.6 33.27,3.12 31.72,2.87 R14.2 28.77,2.92 C21.1 26.77,2.77 25.95,2.77 25.95,6.22 23.62,9.57 R4.2
N$39
  Top 0.254: ADS1292R.3 31.77,8.57 26.67,8.57 26.17,9.32 25.62,10.32 23.67,13.57 23.67,18.67 23.47,19.2 23.47,22.7 22.08,24.27 C22.1 21.32,24.22 20.62,25.22 20.62,34.87 19.35,37.95 R15.2 18.52,38.47 R9.2
N$40
  Top 0.254: R6.2 C19.1 | C19.1 22.17,18.62 | C19.1 23.17,18.47 23.17,13.12 | 23.17,13.12 24.12,11.72 26.2,8 32.27,8 ADS1292R.4 | R11.2 23.17,13.12
N$41
  Top 0.254: U$7.CONNECT 3.57,11.87 5.82,9.62 R4.1
N$42
  Top 0.305: U$10.CONNECT 4.09,34.37 12.87,34.37 R9.1
N$43
  Top 0.254: 22.27,21.72 R6.1 19.12,24.62 3.94,24.62 U$9.CONNECT
N$47
  Top 0.254: 49.17,3.77 49.47,3.92
  Top 0.406: U$12.6 47.82,7.32 47.82,3.92 49.17,3.77 | 49.47,3.92 C25.+
N$48
  Top 0.406: C25.- 44.72,3.97 U$12.3
N$49
  Top 0.254: R16.2 48.32,15.72 43.87,20.22 U2.3
N$50
  Top 0.254: LED6.C 50.47,18.32 R17.1
N$51
  Top 0.254: R17.2 46.52,18.47 44.37,20.57 U2.4
N$52
  Top 0.254: R16.1 LED2.C
N$53
  Top 0.254: R18.1 45.09,25.37 U2.6
N$54
  Top 0.254: X3.2 40.7,27.02 42.37,24.47 43.07,24.47 43.37,24.62 U2.9
N$55
  Top 0.254: R19.1 42.86,21.37 U2.1
N$57
  Top 0.254: U2.7 44.37,26.37 44.27,26.52 43.87,26.92 R21.2
RESET
  Top 0.254: U$4.8 33.95,37.83 34.25,38.12 34.25,40.87 32.92,42.2 32.9,43.05 33.3,43.42 U$1.21
RTS
  Top 0.254: U$4.9 33.58,38.48 33.65,38.55 33.65,39.85 32.12,41.87 32.12,47.07 33.1,47.9 U$1.17
RX
  Top 0.254: U$4.4 35.8,35.23 36.1,35.52 U$1.22
SPI_CLK  (via drill 0.6)
  Top 0.254: v30.97,37.67 31.02,37.17 U$4.7 | ADS1292R.20 32.77,21.12 31.27,22.32 30.82,22.32 v30.87,22.42 30.72,22.57 | U5.2 28.57,27.48 v30.72,26.87
  Bottom 0.254: v30.97,37.67 29.34,37.69 v29.34,33.32 30.72,31.79 v30.72,26.87 30.72,23.22 30.87,22.57 v30.87,22.42
SPI_MISO  (via drill 0.6)
  Top 0.254: v28.42,32.02 28.42,37.21 27.08,37.21 U$4.14 | v29.87,23.27 29.87,22.37 29.97,22.07 30.52,21.57 32.27,20.72 ADS1292R.21 | v29.87,29.92 29.89,29.54 28.2,29.52 27.69,29.54 27.67,29.44 | U5.6 27.38,29.43 27.67,29.44 | U5.5 27.69,28.77 27.7,28.8 27.7,29.56 27.67,29.44
  Bottom 0.254: v28.42,32.02 29.85,32.05 v29.87,29.92 v29.87,23.27
SPI_MOSI  (via drill 0.6)
  Top 0.254: U$4.15 26.7,36.57 27.94,36.57 27.94,35.97 27.95,32.97 27.6,32.54 27.61,32.11 26.52,31.01 26.28,31.01 v25.45,31 | v28.52,19.37 28.37,19.1 28.37,18.97 29.97,17.42 33.27,17.42 ADS1292R.19 | v28.5,28.72 28.32,28.47 28.12,28.35 27.31,28.35 U5.4
  Bottom 0.254: v25.45,31 26.27,31.02 v28.5,28.72 28.5,27.27 28.22,27.27 28.22,19.42 v28.52,19.37
TX
  Top 0.254: U$4.3 37.2,34.57 U$1.23
V+  (via drill 0.6)
  Top 0.254: 32.62,33.25 U$4.1 | R1.2 20.12,47.58 | 20.12,47.58 24.67,49.52 25.02,49.57 | 53.17,7.55 U1.5 53.3,6.71 v53.22,6.62 C20.1 | LED1.A 44.73,33.07 v45.67,32.12 | v30.37,20 C9.1 27.92,20.57 | v30.37,20 30.45,19.99 | 30.45,19.99 31.27,19.92 ADS1292R.23 | R12.1 38.07,17.52 v37.27,18.32 | v30.37,20 30.19,19.95 30.45,19.99 | 25.02,49.57 25.67,50.82 25.67,56.52 27.02,56.52 47.02,56.55 v47.02,54.55 47.07,54.37 | 20.12,47.58 20.97,47.58 C23.+ | R7.2 24.92,49.37 25.02,49.57 | U5.1 29.45,26.65 29.45,26.2 29.52,25.9 | U$4.1 33.72,33.28 v36.27,30.72 | U5.23 26.47,26.05 | 26.47,26.05 26.47,25.63 26.52,25.57 26.97,25.07 27.15,24.67 | 27.15,24.67 29.4,24.67 29.4,25.95 29.52,25.9 | 30.95,27.92 28.1,27.92 27.39,27.91 U5.3 31.21,27.91 C2.1 32.42,26.5 | 30.95,27.92 v31.62,28.5 | 27.15,24.67 26.55,24.02 26.55,23.15 C1.1 | U5.22 26.04,26.48 26.47,26.05 | C10.1 33.01,32.94 U$4.1 | v34.57,25.97 34.05,26.5 32.42,26.5 | 29.52,25.9 31.07,25.9 31.7,26.5 32.42,26.5 | 30.94,27.91 30.95,27.92 | 47.07,54.37 47.07,53.95 U$1.4 | C11.1 47.8,54.7 47.07,54.37
  Bottom 0.254: v47.02,54.55 47.62,56.55 52.55,56.57 52.55,34.47 | 45.92,32.38 48.17,32.37 48.17,34.42 52.55,34.47 | 45.92,32.38 36.27,32.32 v36.27,30.72 36.27,26.02 v34.57,25.97 | v53.22,6.62 56.62,6.67 56.67,6.87 56.67,34.52 52.55,34.47 | v45.67,32.12 45.67,32.03 45.92,32.38 | 37.37,18.42 v37.27,18.32 32.05,18.32 v30.37,20 31.72,21.35 31.72,22.92 31.67,23.17 v31.62,28.5
VDD
  Top 0.254: U4.5 | 51.47,10.32 51.47,10.12 51.47,9.87 | 51.47,6.17 51.47,3.12 51.42,1.37 38.57,1.37 38.57,6.55 | 38.57,6.55 38.57,13.22 37.17,14.82 ADS1292R.12 | C6.1 38.57,6.55 | 50.77,10.07 50.47,10.07 | U$12.5 U$12.4
  Top 0.305: U$12.5 51.33,6.32 51.47,6.17 51.47,9.87
  Top 0.406: U4.5 52.27,10.92 51.47,10.12 | 50.77,10.07 C12.1 51.27,10.07 51.47,9.87
VSS
  Top 0.254: L1.1 U$12.2
  Top 0.406: C26.- 44.22,7.67 L1.1

### Text on the board
tNames: U$3 | + | * | 1 | * | BATTERY | + | * | GPIO | + | + | + | 1 | * | +
tValues: RN42